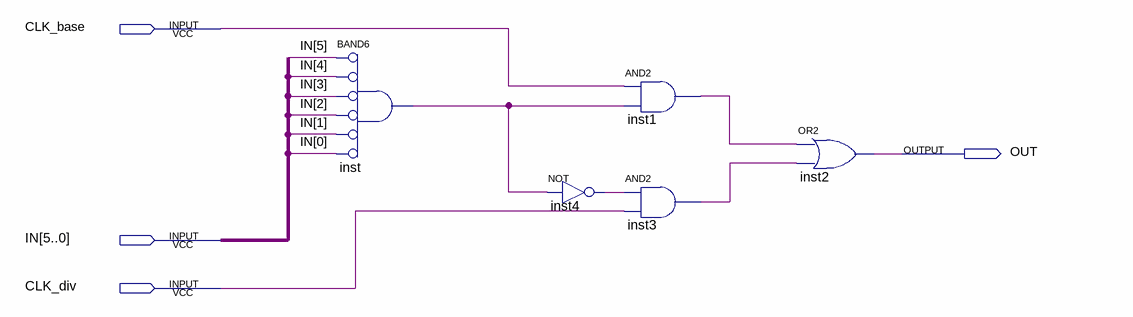
[diagram p0: schematic sheet]
// Quartus schematic clk_bypass.bdf as structural Verilog: 5 symbols, 4 pins
module clk_bypass (
  input  CLK_base,
  input  [5:0] IN,
  input  CLK_div,
  output OUT
);

  wire inst1_out, inst3_out, inst4_out, inst_out;

  and inst (inst_out, ~IN[5], ~IN[4], ~IN[3], ~IN[2], ~IN[1], ~IN[0]);  // BAND6
  not inst4 (inst4_out, inst_out);
  and inst1 (inst1_out, CLK_base, inst_out);
  and inst3 (inst3_out, inst4_out, CLK_div);
  or inst2 (OUT, inst1_out, inst3_out);
endmodule
